# Altium project SmartCar.PrjPcb
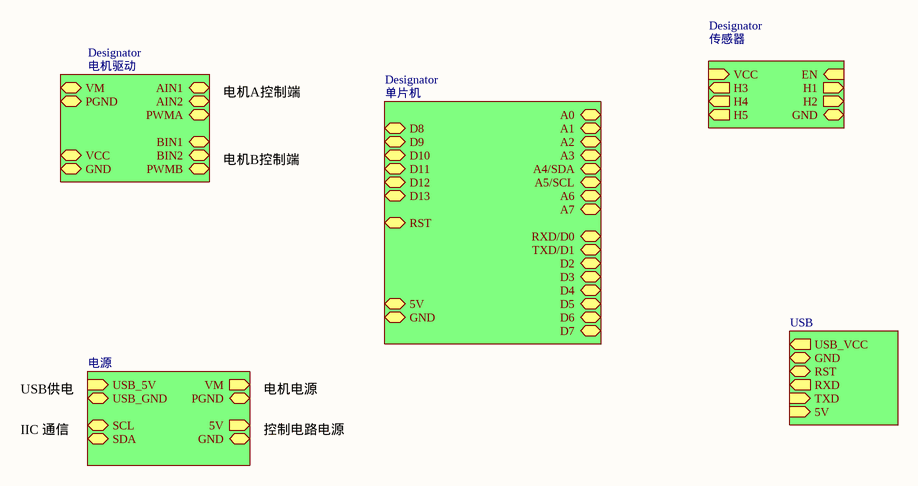
[diagram p0: main.SchDoc]
6 sheets, 98 parts. Net scope: hierarchical (ports join the sheet entries above them; power ports are global).
Sheets:
  main.SchDoc
    Designator = 电机驱动.SchDoc
    Designator = 单片机.SchDoc
    Designator = 传感器.SchDoc
    Designator = USB.SchDoc
    Designator = 电源.SchDoc

## Sheet main.SchDoc
size A4

### Sub-sheets
Designator = 电机驱动: AIN1, AIN2, PWMA, BIN1, BIN2, PWMB, VCC, VM, GND, PGND
Designator = 单片机: A6, A7, A0, A1, A2, A3, A4/SDA, A5/SCL, RXD/D0, TXD/D1, D2, D3, D4, D5, D6, D7, D8, D9, D10, D11, D12, D13, 5V, GND, RST
Designator = 传感器: H1 (out), H2 (out), H3 (out), H4 (out), H5 (out), VCC (in), GND, EN (in)
Designator = USB: TXD (in), RXD (out), RST, GND, USB_VCC (out), 5V (in)
Designator = 电源: GND, VM (out), 5V (out), PGND, USB_5V (in), USB_GND, SCL, SDA

### Nets
5V: sheet Designator/5V, sheet Designator/5V, sheet Designator/5V
GND: sheet Designator/GND, sheet Designator/GND, sheet Designator/GND, sheet Designator/GND
PGND: sheet Designator/PGND, sheet Designator/PGND

### Notes on the sheet
- 电机A控制端
- 电机B控制端
- IIC 通信
- USB供电
- 电机电源
- 控制电路电源

## Sheet 电机驱动.SchDoc
size A4
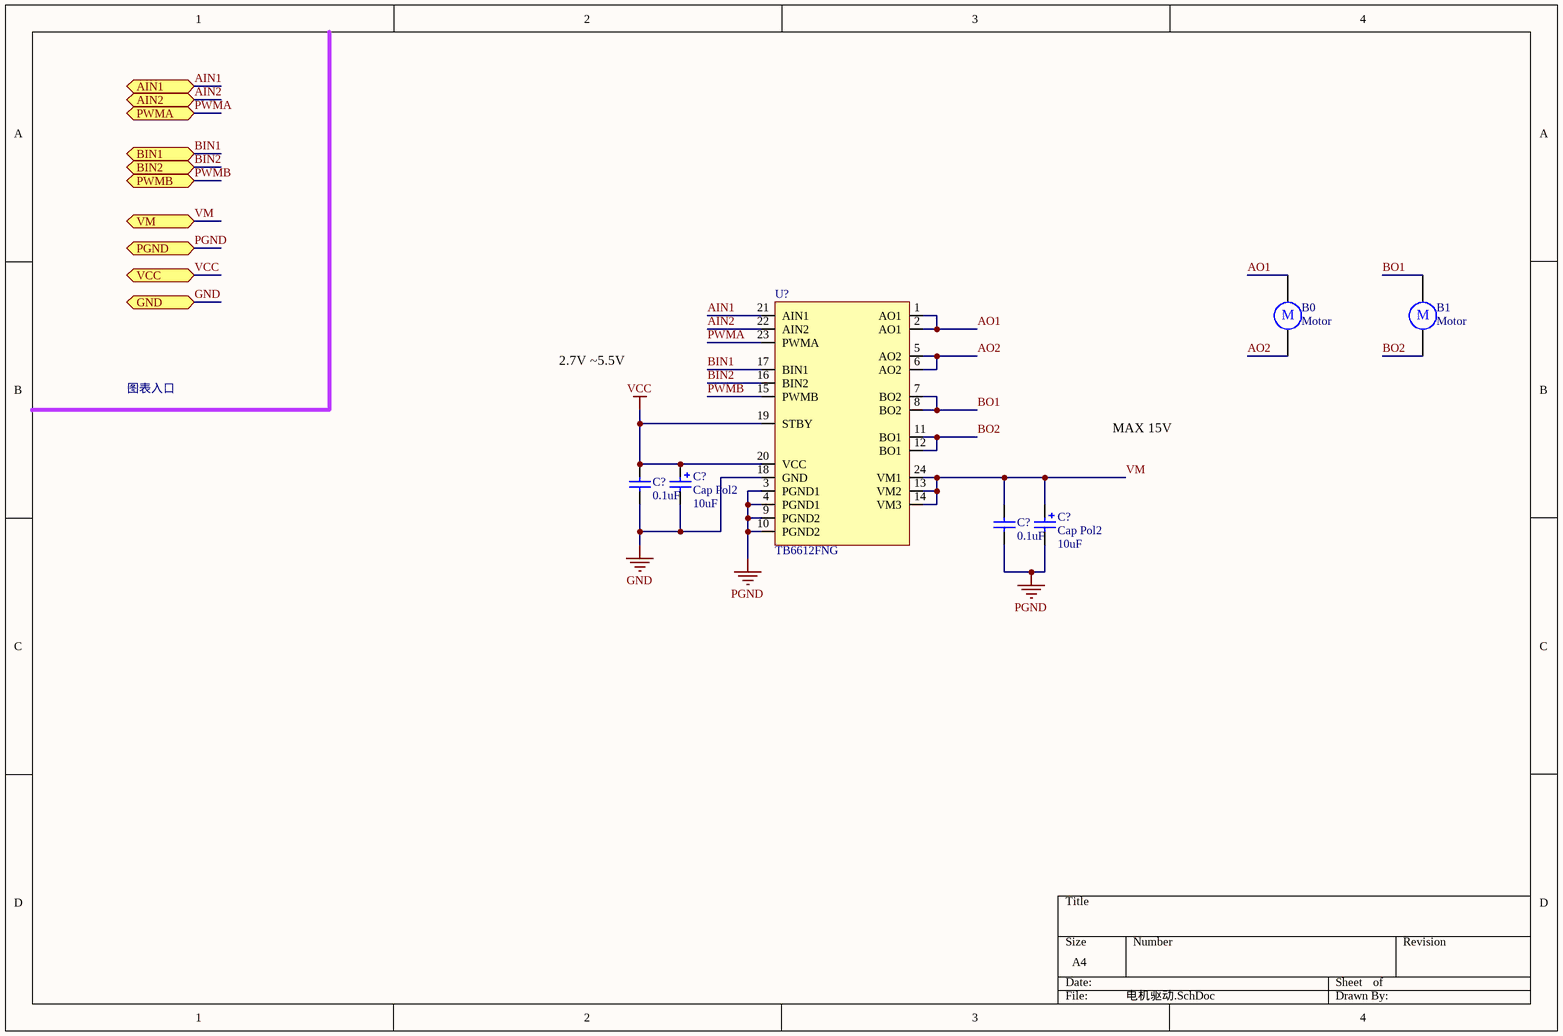
[diagram p1: 电机驱动.SchDoc]

### Parts
(Parts that share a designator on the sheet are numbered #1, #2 ... from top to bottom, then left to right.)
B0#1  Motor  [RB5-10.5]
B1  Motor  [RB5-10.5]
C?#1  Cap Pol2  value 10uF  [POLAR0.8]
C?#2  value 0.1uF  [6-0805_N]  (hidden comment: Cap)
C?#3  Cap Pol2  value 10uF  [POLAR0.8]
C?#4  value 0.1uF  [6-0805_N]  (hidden comment: Cap)
U?#1  TB6612FNG

### Ports
AIN1, AIN2, BIN1, BIN2, GND, PGND, PWMA, PWMB, VCC, VM

### Nets
GND: C?#1.2 C?#2.1 U?#1.18(GND) ; port GND
PGND: C?#3.2 C?#4.1 U?#1.3(PGND1) U?#1.4(PGND1) U?#1.9(PGND2) U?#1.10(PGND2) ; port PGND
VCC: C?#1.1 C?#2.2 U?#1.19(STBY) U?#1.20(VCC) ; port VCC
AIN1: U?#1.21(AIN1) ; port AIN1
AIN2: U?#1.22(AIN2) ; port AIN2
AO1: B0#1.1 U?#1.1(AO1) U?#1.2(AO1)
AO2: B0#1.2 U?#1.5(AO2) U?#1.6(AO2)
BIN1: U?#1.17(BIN1) ; port BIN1
BIN2: U?#1.16(BIN2) ; port BIN2
BO1: B1.1 U?#1.7(BO2) U?#1.8(BO2)
BO2: B1.2 U?#1.11(BO1) U?#1.12(BO1)
PWMA: U?#1.23(PWMA) ; port PWMA
PWMB: U?#1.15(PWMB) ; port PWMB
VM: C?#3.1 C?#4.2 U?#1.13(VM2) U?#1.14(VM3) U?#1.24(VM1) ; port VM

### Notes on the sheet
- 2.7V ~5.5V
- 图表入口
- MAX 15V
- (in symbol Motor) M

### Library data of the parts
B0#1 B1 = Motor: Motor, General Kind; Published: 24-Mar-1999; LatestRevisionDate: 17-Jul-2002; LatestRevisionNote: Re-released for DXP Platform.; PackageReference: RB5-10.5; Publisher: Altium Limited; PackageDescription: Capacitor (Radial); 2 Leads
C?#1 C?#3 = Cap Pol2: Polarized Capacitor (Axial); Published: 8-Jun-2000; LatestRevisionDate: 17-Jul-2002; LatestRevisionNote: Re-released for DXP Platform.; PackageReference: POLAR0.8; Publisher: Altium Limited; PackageDescription: Polarized Capacitor; 2 Leads
C?#2 C?#4 = Cap: Capacitor; Published: 8-Jun-2000; LatestRevisionDate: 17-Jul-2002; LatestRevisionNote: Re-released for DXP Platform.; PackageReference: RAD-0.3; Publisher: Altium Limited; PackageDescription: Radial Cap, Thru-Hole; 2 Leads; 0.3 in Pin Spacing

## Sheet 单片机.SchDoc
size A3
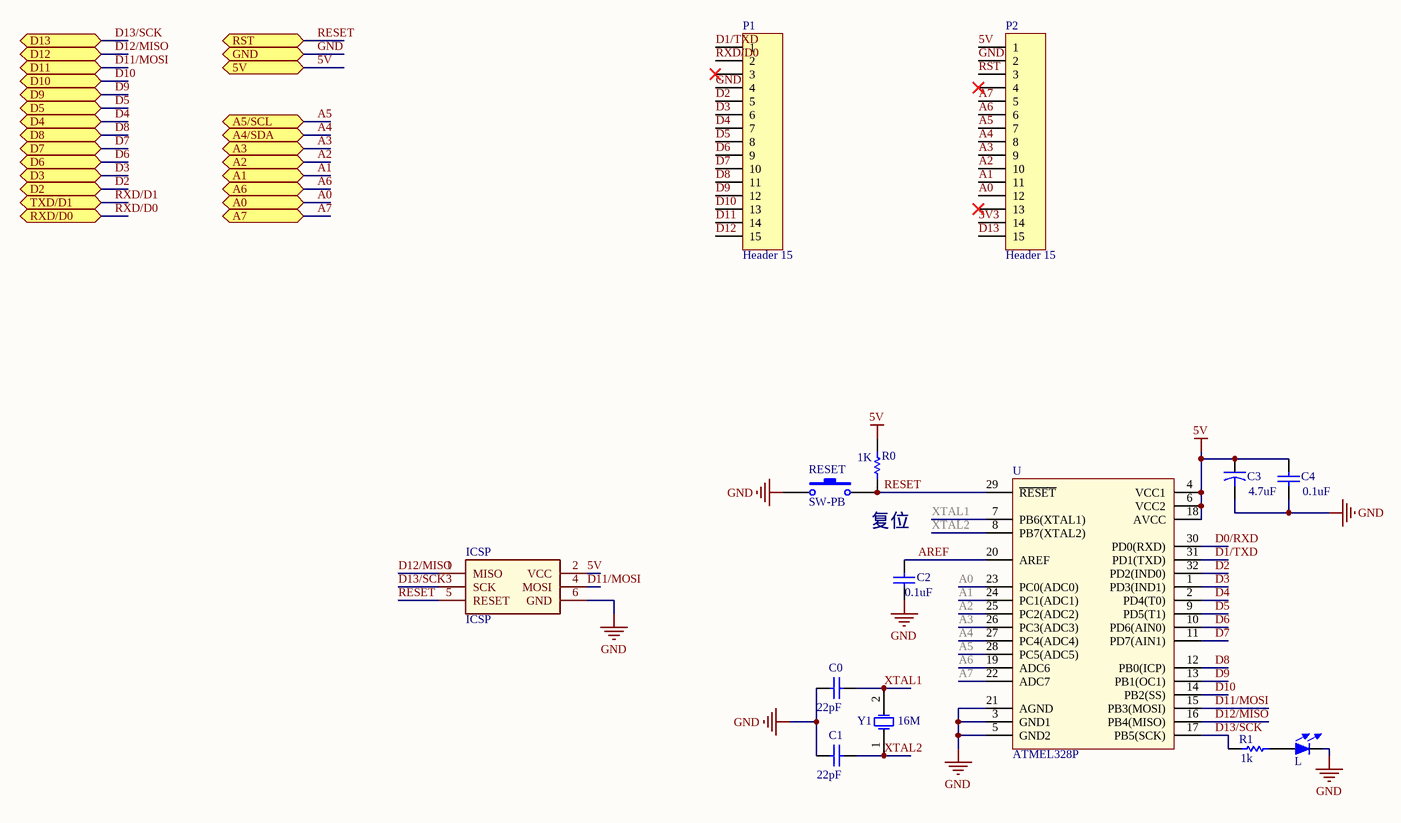
[diagram p2: 单片机.SchDoc]

### Parts
(Parts that share a designator on the sheet are numbered #1, #2 ... from top to bottom, then left to right.)
C0  value 22pF  [6-0805_N]  (hidden comment: Cap)
C1  value 22pF  [6-0805_N]  (hidden comment: Cap)
C2  value 0.1uF  [6-0805_N]  (hidden comment: Cap)
C3  value 4.7uF  [CAPR5-4X5]  (hidden comment: Cap2)
C4#1  value 0.1uF  [6-0805_N]  (hidden comment: Cap)
ICSP  ICSP  [DIP6]
L  LED  [LED_0805]  (value not drawn)
P1  Header 15  [HDR1X15]
P2  Header 15  [HDR1X15]
R0  value 1K  [6-0805_N]  (hidden comment: Res1)
R1#1  value 1k  [6-0805_N]  (hidden comment: Res1)
RESET  SW-PB  [KEY_SODFL_2-Leads]
U  ATMEL328P  [TQFP 32]
Y1  16M  [Crystal_Oscillator]

### Ports
5V, A0, A1, A2, A3, A4/SDA, A5/SCL, A6, A7, D2, D3, D4, D5, D6, D7, D8, D9, D10, D11, D12, D13, GND, RST, RXD/D0, TXD/D1

### Nets
5V: C3.1 C4#1.2 ICSP.2(VCC) P2.1 R0.2 U.4(VCC1) U.6(VCC2) U.18(AVCC) ; port 5V
GND: C0.1 C1.1 C2.1 C3.2 C4#1.1 ICSP.6(GND) L.2 P1.4 P2.2 RESET.1 U.3(GND1) U.5(GND2) U.21(AGND) ; port GND
3V3: P2.14
A0: P2.12 U.23(PC0(ADC0)) ; port A0
A1: P2.11 U.24(PC1(ADC1)) ; port A1
A2: P2.10 U.25(PC2(ADC2)) ; port A2
A3: P2.9 U.26(PC3(ADC3)) ; port A3
A4: P2.8 U.27(PC4(ADC4)) ; port A4/SDA
A5: P2.7 U.28(PC5(ADC5)) ; port A5/SCL
A6: P2.6 U.19(ADC6) ; port A6
A7: P2.5 U.22(ADC7) ; port A7
AREF: C2.2 U.20(AREF)
D0/RXD: U.30(PD0(RXD))
D1/TXD: P1.1 U.31(PD1(TXD))
D2: P1.5 U.32(PD2(IND0)) ; port D2
D3: P1.6 U.1(PD3(IND1)) ; port D3
D4: P1.7 U.2(PD4(T0)) ; port D4
D5: P1.8 U.9(PD5(T1)) ; port D5
D6: P1.9 U.10(PD6(AIN0)) ; port D6
D7: P1.10 U.11(PD7(AIN1)) ; port D7
D8: P1.11 U.12(PB0(ICP)) ; port D8
D9: P1.12 U.13(PB1(OC1)) ; port D9
D10: P1.13 U.14(PB2(SS)) ; port D10
D11: P1.14
D11/MOSI: ICSP.4(MOSI) U.15(PB3(MOSI)) ; port D11
D12: P1.15
D12/MISO: ICSP.1(MISO) U.16(PB4(MISO)) ; port D12
D13: P2.15
D13/SCK: ICSP.3(SCK) R1#1.2 U.17(PB5(SCK)) ; port D13
RESET: ICSP.5(RESET) R0.1 RESET.2 U.29(~{RESET}) ; port RST
RST: P2.3
RXD/D0: P1.2 ; port RXD/D0
RXD/D1: port TXD/D1
XTAL1: C0.2 U.7(PB6(XTAL1)) Y1.2(OSC2)
XTAL2: C1.2 U.8(PB7(XTAL2)) Y1.1(OSC1)
NetL_1: L.1 R1#1.1

Not connected (* = marked no-connect by the designer): P1 3*; P2 4* 13*

### Notes on the sheet
- 复位

### Library data of the parts
C0-C2 C4#1 = Cap: Capacitor; Published: 8-Jun-2000; LatestRevisionDate: 17-Jul-2002; LatestRevisionNote: Re-released for DXP Platform.; PackageReference: RAD-0.3; Publisher: Altium Limited; PackageDescription: Radial Cap, Thru-Hole; 2 Leads; 0.3 in Pin Spacing
C3 = Cap2: Capacitor; Published: 23-Sep-2002; PackageReference: CAPR5-4X5; Publisher: Altium Limited; PackageDescription: Capacitor; 2 Leads
P1 P2 = Header 15: Header, 15-Pin; LatestRevisionDate: 17-Jul-2002; LatestRevisionNote: Re-released for DXP Platform.; Publisher: Altium Limited
R0 R1#1 = Res1: Resistor; Published: 8-Jun-2000; LatestRevisionDate: 17-Jul-2002; LatestRevisionNote: Re-released for DXP Platform.; PackageReference: AXIAL-0.3; Publisher: Altium Limited; PackageDescription: Axial Device, Thru-Hole; 2 Leads; 0.3 in Pin Spacing
RESET = SW-PB: Switch; Published: 24-Mar-1999; LatestRevisionDate: 17-Jul-2002; LatestRevisionNote: Re-released for DXP Platform.; PackageReference: SPST-2; Publisher: Altium Limited; PackageDescription: Switch; 2 Leads
U = ATMEL-328P
Y1 = XTAL: Crystal Oscillator; Published: 8-Jun-2000; LatestRevisionDate: 17-Jul-2002; LatestRevisionNote: Re-released for DXP Platform.; PackageReference: R38; Publisher: Altium Limited; PackageDescription: Crystal, Thru-Hole; 2 Leads; Body 3.1 x 8.2 mm (Dia.xH)

## Sheet 传感器.SchDoc
size A3
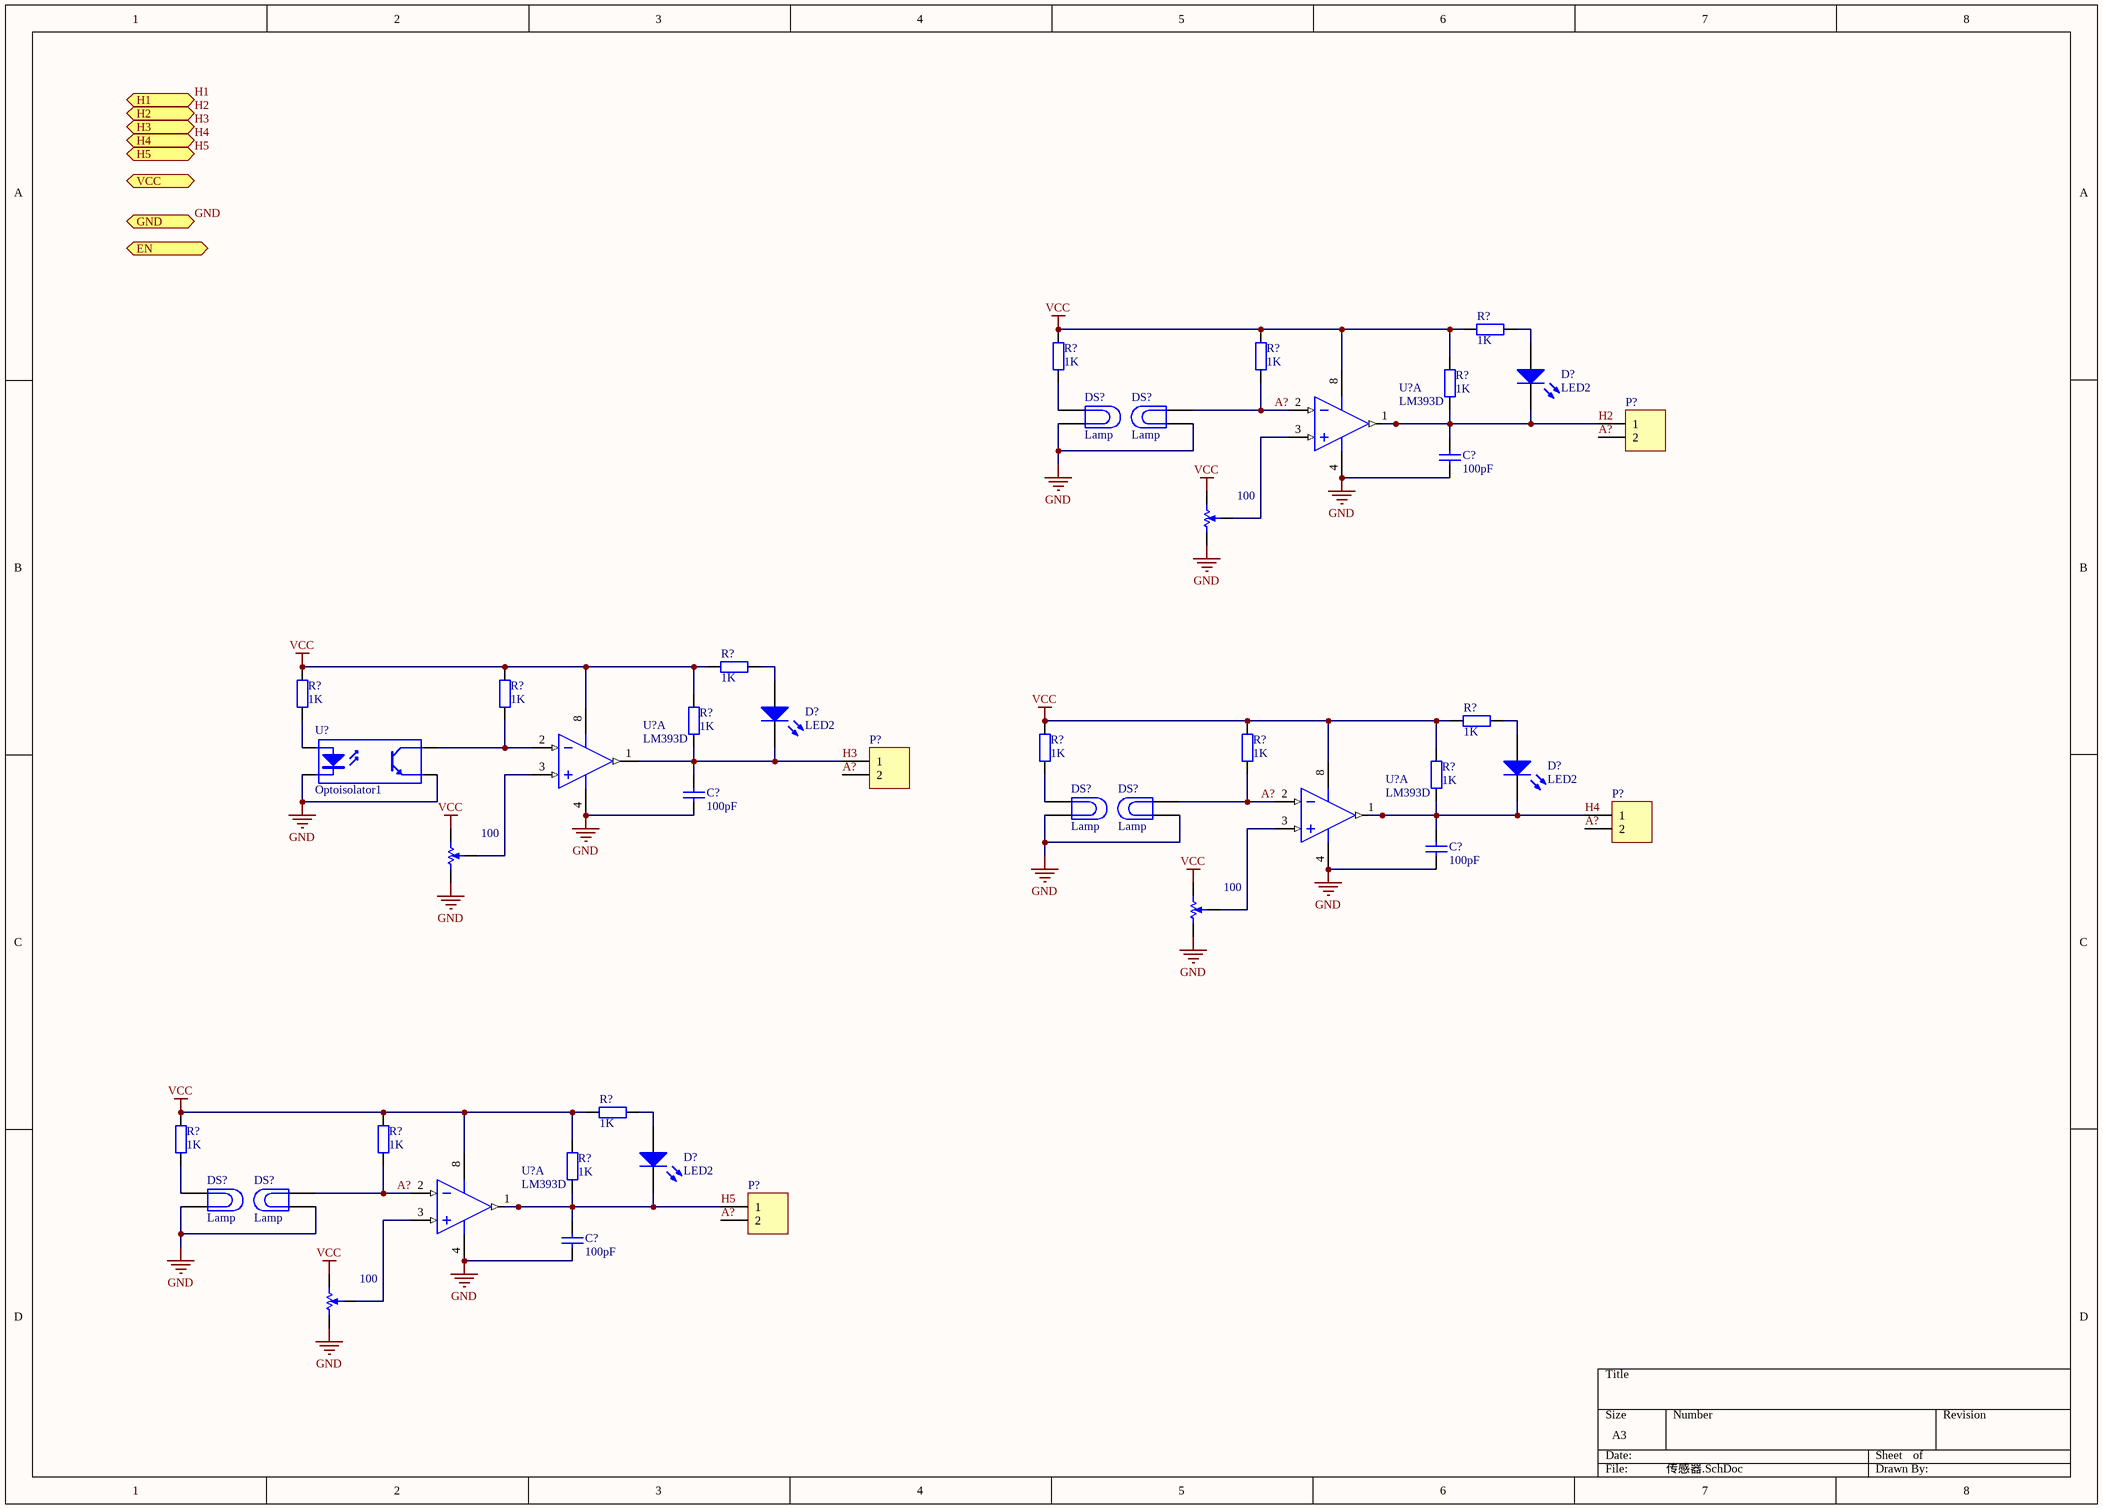
[diagram p3: 传感器.SchDoc]

### Parts
(Parts that share a designator on the sheet are numbered #1, #2 ... from top to bottom, then left to right.)
100#1  RPot SM  [POT4MM-2]  (value not drawn)
100#2  RPot SM  [POT4MM-2]  (value not drawn)
100#3  RPot SM  [POT4MM-2]  (value not drawn)
100#4  RPot SM  [POT4MM-2]  (value not drawn)
C?#5  value 100pF  [6-0805_N]  (hidden comment: Cap)
C?#6  value 100pF  [6-0805_N]  (hidden comment: Cap)
C?#7  value 100pF  [6-0805_N]  (hidden comment: Cap)
C?#8  value 100pF  [6-0805_N]  (hidden comment: Cap)
D?#1  LED2  [3.2X1.6X1.1]
D?#2  LED2  [3.2X1.6X1.1]
D?#3  LED2  [3.2X1.6X1.1]
D?#4  LED2  [3.2X1.6X1.1]
DS?#1  Lamp  [PIN2]
DS?#2  Lamp  [PIN2]
DS?#3  Lamp  [PIN2]
DS?#4  Lamp  [PIN2]
DS?#5  Lamp  [PIN2]
DS?#6  Lamp  [PIN2]
P?#1  (no value)  [HDR1X2]
P?#2  (no value)  [HDR1X2]
P?#3  (no value)  [HDR1X2]
P?#4  (no value)  [HDR1X2]
R?#1  value 1K  [6-0805_N]  (hidden comment: Res2)
R?#2  value 1K  [6-0805_N]  (hidden comment: Res2)
R?#3  value 1K  [6-0805_N]  (hidden comment: Res2)
R?#4  value 1K  [6-0805_N]  (hidden comment: Res2)
R?#5  value 1K  [6-0805_N]  (hidden comment: Res2)
R?#6  value 1K  [6-0805_N]  (hidden comment: Res2)
R?#7  value 1K  [6-0805_N]  (hidden comment: Res2)
R?#8  value 1K  [6-0805_N]  (hidden comment: Res2)
R?#9  value 1K  [6-0805_N]  (hidden comment: Res2)
R?#10  value 1K  [6-0805_N]  (hidden comment: Res2)
R?#11  value 1K  [6-0805_N]  (hidden comment: Res2)
R?#12  value 1K  [6-0805_N]  (hidden comment: Res2)
R?#13  value 1K  [6-0805_N]  (hidden comment: Res2)
R?#14  value 1K  [6-0805_N]  (hidden comment: Res2)
R?#15  value 1K  [6-0805_N]  (hidden comment: Res2)
R?#16  value 1K  [6-0805_N]  (hidden comment: Res2)
U?#2  LM393D  [751-02_N]  (part A of 2)
U?#3  Optoisolator1  [DIP-4]
U?#4  LM393D  [751-02_N]  (part A of 2)
U?#5  LM393D  [751-02_N]  (part A of 2)
U?#6  LM393D  [751-02_N]  (part A of 2)

### Ports
EN (in), GND, H1 (out), H2 (out), H3 (out), H4 (out), H5 (out), VCC (in)

### Nets
GND: 100#1.CCW(-) 100#2.CCW(-) 100#3.CCW(-) 100#4.CCW(-) C?#5.1 C?#6.1 C?#7.1 C?#8.1 DS?#1.2 DS?#2.1 DS?#3.2 DS?#4.1 DS?#5.2 DS?#6.1 U?#2.4(GND) U?#3.2(K) U?#3.3(E) U?#4.4(GND) U?#5.4(GND) U?#6.4(GND) ; port GND
VCC: 100#1.CW(+) 100#2.CW(+) 100#3.CW(+) 100#4.CW(+) R?#1.1 R?#2.2 R?#3.2 R?#4.2 R?#5.1 R?#6.2 R?#7.2 R?#8.1 R?#9.2 R?#10.2 R?#11.2 R?#12.2 R?#13.1 R?#14.2 R?#15.2 R?#16.2 U?#2.8(V+) U?#4.8(V+) U?#5.8(V+) U?#6.8(V+)
A?: DS?#2.2 DS?#4.2 DS?#6.2 P?#1.2 P?#2.2 P?#3.2 P?#4.2 R?#3.1 R?#11.1 R?#15.1 U?#2.2(IN-) U?#5.2(IN-) U?#6.2(IN-)
H1: port H1
H2: C?#5.2 D?#1.2(K) P?#1.1 R?#4.1 U?#2.1(OUT) ; port H2
H3: C?#6.2 D?#2.2(K) P?#2.1 R?#9.1 U?#4.1(OUT) ; port H3
H4: C?#7.2 D?#3.2(K) P?#3.1 R?#12.1 U?#5.1(OUT) ; port H4
H5: C?#8.2 D?#4.2(K) P?#4.1 R?#16.1 U?#6.1(OUT) ; port H5
Net100#1_W: 100#1.W U?#2.3(IN+)
Net100#2_W: 100#2.W U?#4.3(IN+)
Net100#3_W: 100#3.W U?#5.3(IN+)
Net100#4_W: 100#4.W U?#6.3(IN+)
NetD?#1_1: D?#1.1(A) R?#1.2
NetD?#2_1: D?#2.1(A) R?#5.2
NetD?#3_1: D?#3.1(A) R?#8.2
NetD?#4_1: D?#4.1(A) R?#13.2
NetDS?#1_1: DS?#1.1 R?#2.1
NetDS?#3_1: DS?#3.1 R?#10.1
NetDS?#5_1: DS?#5.1 R?#14.1
NetR?#6_1: R?#6.1 U?#3.1(A)
NetR?#7_1: R?#7.1 U?#3.4(C) U?#4.2(IN-)

### Library data of the parts
100#1-100#4 = RPot SM: Square Trimming Potentiometer; Published: 17-Dec-2003; DatasheetVersion: Oct-2003; PackageReference: POT4MM-2; Publisher: Altium Limited; PackageDescription: Square Trimming Potentiometer; ComponentLink1Description: Manufacturer Link; ComponentLink1URL: http://bourns.com/2/search.html
C?#5-C?#8 = Cap: Capacitor; Published: 8-Jun-2000; LatestRevisionDate: 17-Jul-2002; LatestRevisionNote: Re-released for DXP Platform.; PackageReference: RAD-0.3; Publisher: Altium Limited; PackageDescription: Radial Cap, Thru-Hole; 2 Leads; 0.3 in Pin Spacing
D?#1-D?#4 = LED2: Typical RED, GREEN, YELLOW, AMBER GaAs LED; Published: 8-Jun-2000; LatestRevisionDate: 17-Jul-2002; LatestRevisionNote: Re-released for DXP Platform.; PackageVersion: Feb-2002; PackageReference: 3.2X1.6X1.1; Publisher: Altium Limited; PackageDescription: SM LED; 2 Flat Leads
DS?#1-DS?#6 = Lamp: Incandescent Bulb; Published: 24-Mar-1999; LatestRevisionDate: 17-Jul-2002; LatestRevisionNote: Re-released for DXP Platform.; PackageReference: PIN2; Publisher: Altium Limited
P?#1-P?#4 = Header 2: Header, 2-Pin; LatestRevisionDate: 17-Jul-2002; LatestRevisionNote: Re-released for DXP Platform.; Publisher: Altium Limited
R?#1-R?#16 = Res2: Resistor; Published: 8-Jun-2000; LatestRevisionDate: 17-Jul-2002; LatestRevisionNote: Re-released for DXP Platform.; PackageReference: AXIAL-0.4; Publisher: Altium Limited; PackageDescription: Axial Device, Thru-Hole; 2 Leads; 0.4 in Pin Spacing
U?#2 U?#4-U?#6 = LM393D: Dual Comparator; Published: 17-Jul-2002; LatestRevisionDate: 13-Apr-2006; LatestRevisionNote: IPC-7351 Footprint Added.; DatasheetVersion: 1988; PackageReference: 751-02; Publisher: Altium Limited; PackageDescription: 8-Pin Small Outline Integrated Circuit 1.27 mm Pitch; Code_JEDEC: MS-012-AA; Code_IPC: SOIC127P600-8; ComponentLink1Description: Manufacturer Link; ComponentLink1URL: http://www.onsemi.com/site/products/taxonomy/0,4438,133,00.html
U?#3 = Optoisolator1: 4-Pin Phototransistor Optocoupler; Published: 24-Mar-1999; LatestRevisionDate: 04-Mar-2005; LatestRevisionNote: Sch pins 3 & 4 Swapped.; DatasheetVersion: Nov-2003; PackageReference: DIP-4; Publisher: Altium Limited

## Sheet USB.SchDoc
size A4
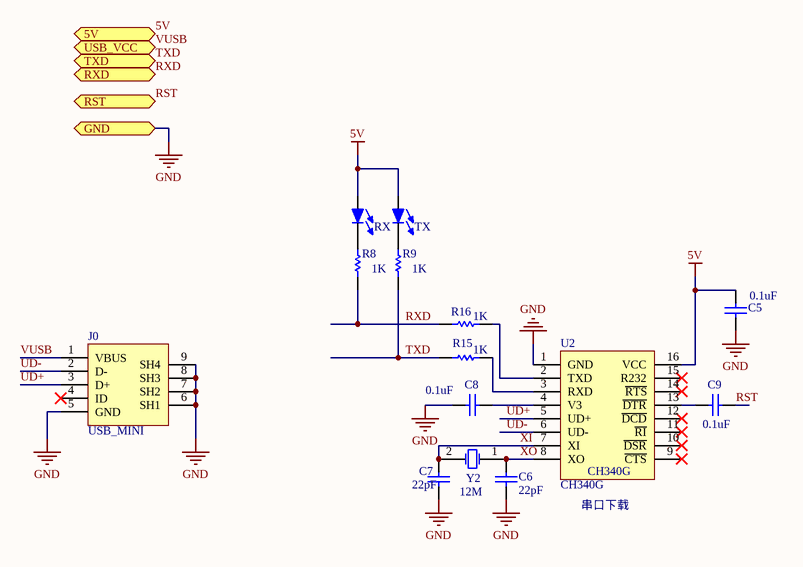
[diagram p4: USB.SchDoc]

### Parts
(Parts that share a designator on the sheet are numbered #1, #2 ... from top to bottom, then left to right.)
C5#1  value 0.1uF  [6-0805_N]  (hidden comment: Cap)
C6#1  value 22pF  [6-0805_N]  (hidden comment: Cap)
C7#1  value 22pF  [6-0805_N]  (hidden comment: Cap)
C8#1  value 0.1uF  [6-0805_N]  (hidden comment: Cap)
C9  value 0.1uF  [6-0805_N]  (hidden comment: Cap)
J0  USB_MINI  [MICRO_USB]
R8#1  value 1K  [6-0805_N]  (hidden comment: Res1)
R9  value 1K  [6-0805_N]  (hidden comment: Res1)
R15  value 1K  [6-0805_N]  (hidden comment: Res1)
R16  value 1K  [6-0805_N]  (hidden comment: Res1)
RX  LED  [LED_0805]  (value not drawn)
TX  LED  [LED_0805]  (value not drawn)
U2#1  CH340G  [SOP16]
Y2  12M  [Crystal_Oscillator]

### Ports
5V (in), GND, RST, RXD (out), TXD (in), USB_VCC (out)

### Nets
5V: C5#1.2 RX.1 TX.1 U2#1.16(VCC) ; port 5V
GND: C5#1.1 C6#1.1 C7#1.1 C8#1.1 J0.5(GND) J0.6(SH1) J0.7(SH2) J0.8(SH3) J0.9(SH4) U2#1.1(GND) ; port GND
RST: C9.2 ; port RST
RXD: R8#1.1 R16.1 ; port RXD
TXD: R9.1 R15.1 ; port TXD
UD+: J0.3(D+) U2#1.5(UD+)
UD-: J0.2(D-) U2#1.6(UD-)
VUSB: J0.1(VBUS) ; port USB_VCC
XI: C7#1.2 U2#1.7(XI) Y2.2(OSC2)
XO: C6#1.2 U2#1.8(XO) Y2.1(OSC1)
NetC8#1_2: C8#1.2 U2#1.4(V3)
NetC9_1: C9.1 U2#1.13(~{DTR})
NetR8#1_2: R8#1.2 RX.2
NetR9_2: R9.2 TX.2
NetR15_2: R15.2 U2#1.3(RXD)
NetR16_2: R16.2 U2#1.2(TXD)

Not connected (* = marked no-connect by the designer): J0 4(ID)*; U2#1 9(~{CTS})* 10(~{DSR})* 11(~{RI})* 12(~{DCD})* 14(~{RTS})* 15(R232)*

### Notes on the sheet
- (near U2#1) 串口下载

### Library data of the parts
C5#1 C6#1 C7#1 C8#1 C9 = Cap: Capacitor; Published: 8-Jun-2000; LatestRevisionDate: 17-Jul-2002; LatestRevisionNote: Re-released for DXP Platform.; PackageReference: RAD-0.3; Publisher: Altium Limited; PackageDescription: Radial Cap, Thru-Hole; 2 Leads; 0.3 in Pin Spacing
R8#1 R9 R15 R16 = Res1: Resistor; Published: 8-Jun-2000; LatestRevisionDate: 17-Jul-2002; LatestRevisionNote: Re-released for DXP Platform.; PackageReference: AXIAL-0.3; Publisher: Altium Limited; PackageDescription: Axial Device, Thru-Hole; 2 Leads; 0.3 in Pin Spacing
Y2 = XTAL: Crystal Oscillator; Published: 8-Jun-2000; LatestRevisionDate: 17-Jul-2002; LatestRevisionNote: Re-released for DXP Platform.; PackageReference: R38; Publisher: Altium Limited; PackageDescription: Crystal, Thru-Hole; 2 Leads; Body 3.1 x 8.2 mm (Dia.xH)

## Sheet 电源.SchDoc
size A4
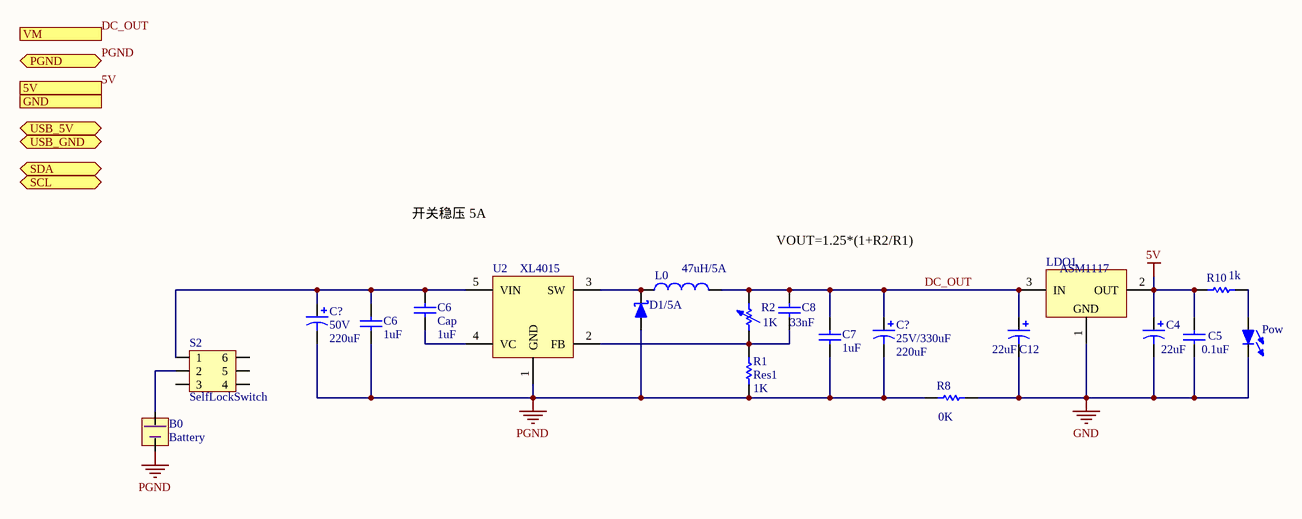
[diagram p5: 电源.SchDoc]

### Parts
(Parts that share a designator on the sheet are numbered #1, #2 ... from top to bottom, then left to right.)
B0#2  Battery  [LI]
C4#2  value 22uF  [LC-CASE-B_3528]  (hidden comment: Cap Pol3)
C5#2  value 0.1uF  [6-0805_N]  (hidden comment: Cap)
C6#2  Cap  value 1uF  [6-0805_N]
C6#3  value 1uF  [6-0805_N]  (hidden comment: Cap)
C7#2  value 1uF  [6-0805_N]  (hidden comment: Cap)
C8#2  value 33nF  [6-0805_N]  (hidden comment: Cap)
C12  value 22uF  [LC-CASE-B_3528]  (hidden comment: Cap Pol3)
C?#9  50V  value 220uF  [RB7.6-15]
C?#10  25V/330uF  value 220uF  [RB7.6-15]
D1/5A  Diode-Schottky  [Diode-Schottky]  (value not drawn)
L0  value 47uH/5A  [0402-A]  (hidden comment: Inductor)
LDO1  ASM1117  [SOT-223]
Pow  LED  [LED_0805]  (value not drawn)
R1#2  Res1  value 1K  [AXIAL-0.3]
R2  value 1K  [AXIAL-0.7]  (hidden comment: Res Adj1)
R8#2  value 0K  [AXIAL-0.3]  (hidden comment: Res1)
R10  value 1k  [6-0805_N]  (hidden comment: Res1)
S2  SelfLockSwitch  [KEY_ZS_5.8*5.8]
U2#2  XL4015

### Ports
5V (out), GND, PGND, SCL, SDA, USB_5V (in), USB_GND, VM (out)

### Nets
5V: C4#2.1 C5#2.2 LDO1.2(OUT) R10.2 ; port 5V
GND: C4#2.2 C5#2.1 C12.2 LDO1.1 Pow.2 R8#2.2
PGND: B0#2.2 C6#3.1 C7#2.1 C?#9.2 C?#10.2 D1/5A.1 R1#2.1 R8#2.1 U2#2.1(GND) ; port PGND
DC_OUT: C7#2.2 C8#2.2 C12.1 C?#10.1 L0.2 LDO1.3(IN) R2.2 ; port VM
NetB0#2_1: B0#2.1(+) S2.2
NetC6#2_1: C6#2.1 U2#2.4(VC)
NetC6#2_2: C6#2.2 C6#3.2 C?#9.1 S2.1 U2#2.5(VIN)
NetC8#2_1: C8#2.1 R1#2.2 R2.1 U2#2.2(FB)
NetD1/5A_2: D1/5A.2 L0.1 U2#2.3(SW)
NetPow_1: Pow.1 R10.1

Not connected (* = marked no-connect by the designer): S2 3 4 5 6

### Notes on the sheet
- 开关稳压 5A
- VOUT=1.25*(1+R2/R1)
- (in symbol ASM1117) GND

### Library data of the parts
B0#2 = Battery: 电池
C4#2 C12 = Cap Pol3: Polarized Capacitor (Surface Mount); Published: 8-Jun-2000; LatestRevisionDate: 29-May-2009; LatestRevisionNote: IPC-7351 Footprint Added.; PackageReference: C0805; Publisher: Altium Limited; PackageDescription: Chip Capacitor
C5#2 C6#2 C6#3 C7#2 C8#2 = Cap: Capacitor; Published: 8-Jun-2000; LatestRevisionDate: 17-Jul-2002; LatestRevisionNote: Re-released for DXP Platform.; PackageReference: RAD-0.3; Publisher: Altium Limited; PackageDescription: Radial Cap, Thru-Hole; 2 Leads; 0.3 in Pin Spacing
C?#9 C?#10 = Cap Pol1: Polarized Capacitor (Radial); Published: 8-Jun-2000; LatestRevisionDate: 17-Jul-2002; LatestRevisionNote: Re-released for DXP Platform.; PackageReference: RB7.6-15; Publisher: Altium Limited; PackageDescription: Polarized Capacitor (Radial); 2 Leads
L0 = Inductor: Code_IEC: 1005; Published: 8-Jun-2000; LatestRevisionDate: 29-May-2009; LatestRevisionNote: IPC-7351 Footprint Added.; PackageReference: 0402-A; Publisher: Altium Limited; PackageDescription: Chip Inductor; Code_JEITA: 0402
LDO1 = ASM1117: 线性稳压
R1#2 R8#2 R10 = Res1: Resistor; Published: 8-Jun-2000; LatestRevisionDate: 17-Jul-2002; LatestRevisionNote: Re-released for DXP Platform.; PackageReference: AXIAL-0.3; Publisher: Altium Limited; PackageDescription: Axial Device, Thru-Hole; 2 Leads; 0.3 in Pin Spacing
R2 = Res Adj1: Variable Resistor; Set Position: 0.5; Published: 8-Jun-2000; LatestRevisionDate: 17-Jul-2002; LatestRevisionNote: Re-released for DXP Platform.; PackageReference: AXIAL-0.7; Publisher: Altium Limited; PackageDescription: Axial Device, Thru-Hole; 2 Leads; 0.7 in Pin Spacing
U2#2 = XL4015: 开关降压型 DC-DC 转换芯片 最大5A 输出

## Nets that join several sheets
5V: 单片机 (8 pins), USB (C5#1.2 RX.1 TX.1 U2#1.16), 电源 (C4#2.1 C5#2.2 LDO1.2 R10.2)
GND: 电机驱动 (C?#1.2 C?#2.1 U?#1.18), 单片机 (13 pins), 传感器 (20 pins), USB (10 pins), 电源 (6 pins)
PGND: 电机驱动 (6 pins), 电源 (9 pins)
VCC: 电机驱动 (C?#1.1 C?#2.2 U?#1.19 U?#1.20), 传感器 (24 pins)